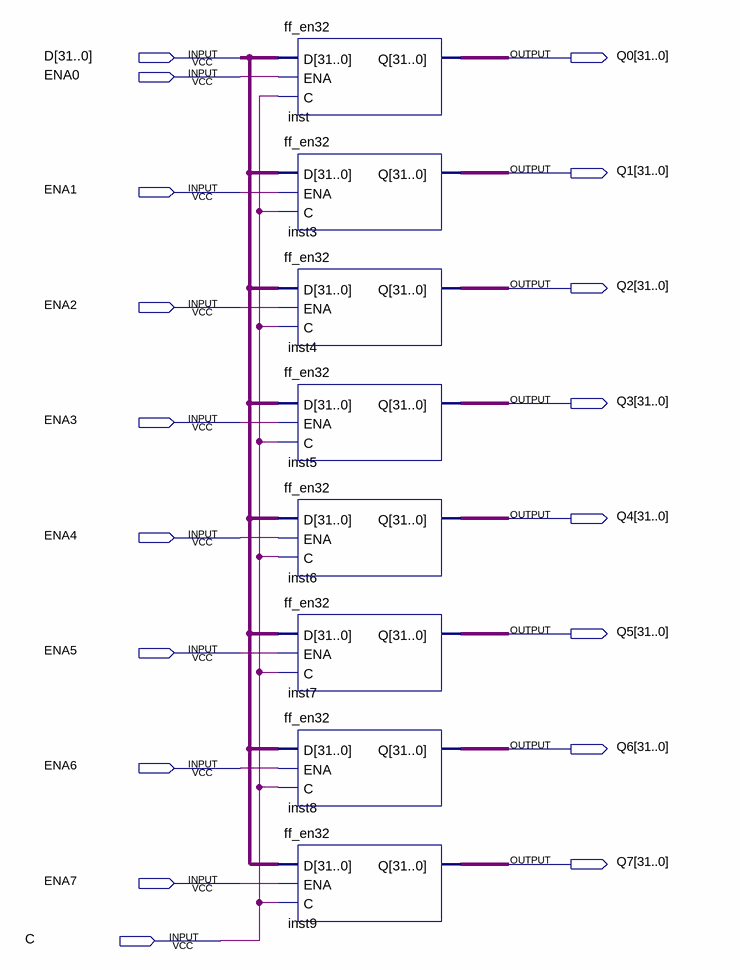
[diagram p0: schematic sheet]
// Quartus schematic ff8_en32_0.bdf as structural Verilog: 8 symbols, 18 pins
module ff8_en32_0 (
  input  [31:0] D,
  input  ENA0,
  input  ENA1,
  input  ENA2,
  input  ENA3,
  input  ENA4,
  input  ENA5,
  input  ENA6,
  input  ENA7,
  input  C,
  output [31:0] Q0,
  output [31:0] Q1,
  output [31:0] Q2,
  output [31:0] Q3,
  output [31:0] Q4,
  output [31:0] Q5,
  output [31:0] Q6,
  output [31:0] Q7
);

  ff_en32 inst (.D(D), .ENA(ENA0), .C(C), .Q(Q0));
  ff_en32 inst3 (.D(D), .ENA(ENA1), .C(C), .Q(Q1));
  ff_en32 inst4 (.D(D), .ENA(ENA2), .C(C), .Q(Q2));
  ff_en32 inst5 (.D(D), .ENA(ENA3), .C(C), .Q(Q3));
  ff_en32 inst6 (.D(D), .ENA(ENA4), .C(C), .Q(Q4));
  ff_en32 inst7 (.D(D), .ENA(ENA5), .C(C), .Q(Q5));
  ff_en32 inst8 (.D(D), .ENA(ENA6), .C(C), .Q(Q6));
  ff_en32 inst9 (.D(D), .ENA(ENA7), .C(C), .Q(Q7));
endmodule
